# EAGLE design ema-module (EAGLE 9.6.2)
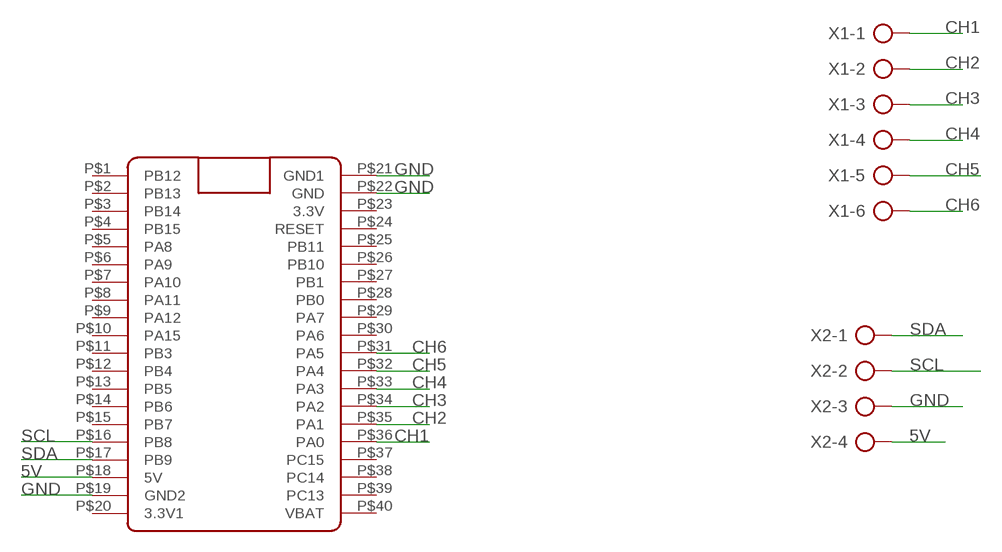
[diagram p0: schematic, sheet 1]

## Parts
U$1  BLUE_PILL  [BLUE_PILL]
X1  AK500/6-H  [AK500/6-H]
X2  AK500/4-H  [AK500/4-H]

## Nets
5V: U$1.P$18(5V) X2.4
CH1: U$1.P$36(PA0) X1.1
CH2: U$1.P$35(PA1) X1.2
CH3: U$1.P$34(PA2) X1.3
CH4: U$1.P$33(PA3) X1.4
CH5: U$1.P$32(PA4) X1.5
CH6: U$1.P$31(PA5) X1.6
GND: U$1.P$19(GND2) U$1.P$21(GND1) U$1.P$22(GND) X2.3
SCL: U$1.P$16(PB8) X2.2
SDA: U$1.P$17(PB9) X2.1
Unconnected: U$1.P$1(PB12) U$1.P$2(PB13) U$1.P$3(PB14) U$1.P$4(PB15) U$1.P$5(PA8) U$1.P$6(PA9) U$1.P$7(PA10) U$1.P$8(PA11) U$1.P$9(PA12) U$1.P$10(PA15) U$1.P$11(PB3) U$1.P$12(PB4) U$1.P$13(PB5) U$1.P$14(PB6) U$1.P$15(PB7) U$1.P$20(3.3V1) U$1.P$23(3.3V) U$1.P$24(RESET) U$1.P$25(PB11) U$1.P$26(PB10) U$1.P$27(PB1) U$1.P$28(PB0) U$1.P$29(PA7) U$1.P$30(PA6) U$1.P$37(PC15) U$1.P$38(PC14) U$1.P$39(PC13) U$1.P$40(VBAT)

## Library data of the parts
U$1 = BluePill:BLUE_PILL
X1 = con-ptr500:AK500/6-H: CONNECTOR Aug. 2004 / PTR Meßtechnik: Die Bezeichnung der Serie AK505 wurde geändert. Es handelt sich hierbei um AK500 in horizontaler Ausführung.
X2 = con-ptr500:AK500/4-H: CONNECTOR Aug. 2004 / PTR Meßtechnik: Die Bezeichnung der Serie AK505 wurde geändert. Es handelt sich hierbei um AK500 in horizontaler Ausführung.; OC_FARNELL: unknown; OC_NEWARK: unknown

## Board
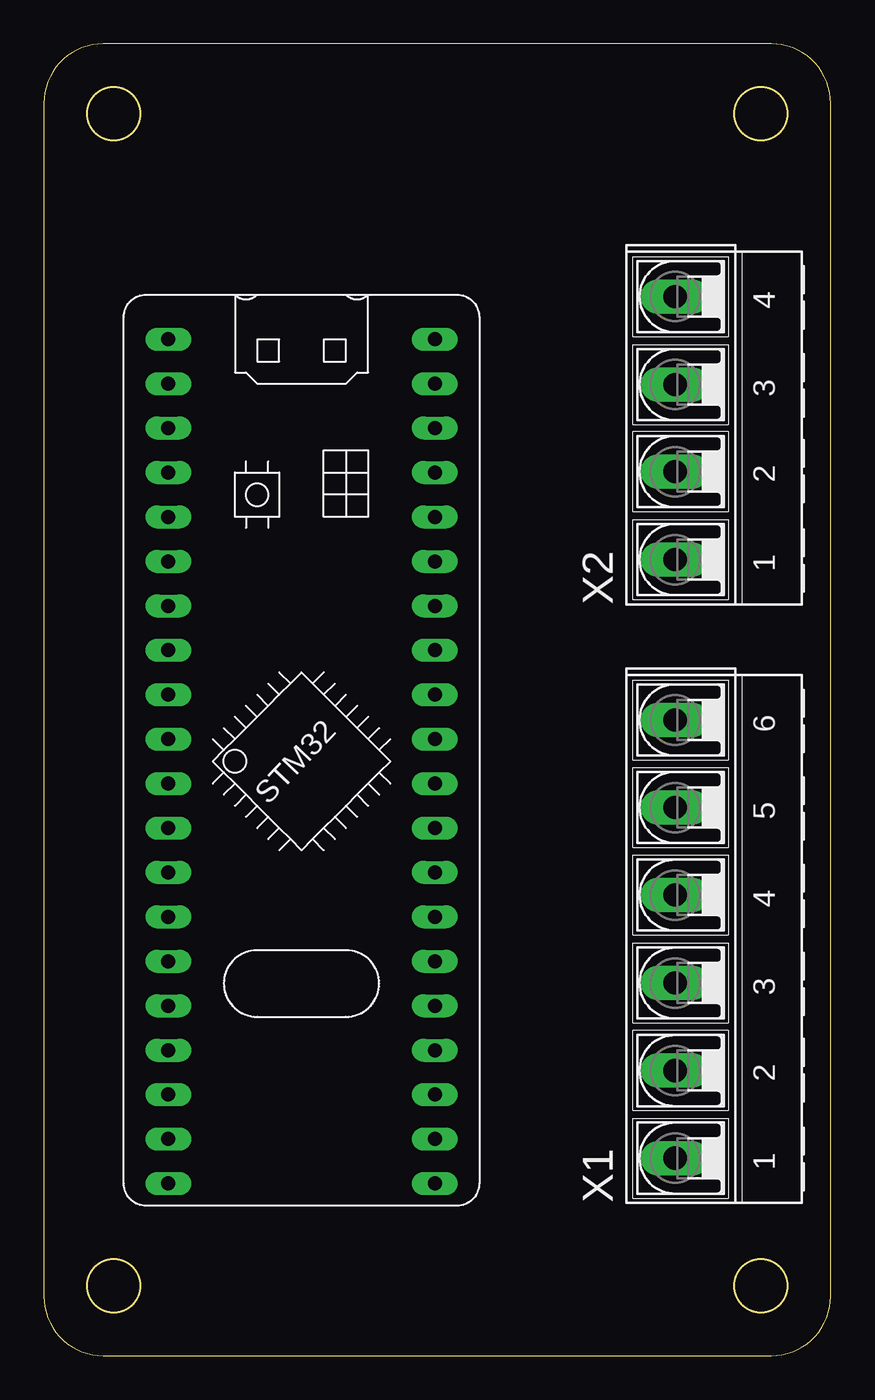
[diagram p1: board, top side]
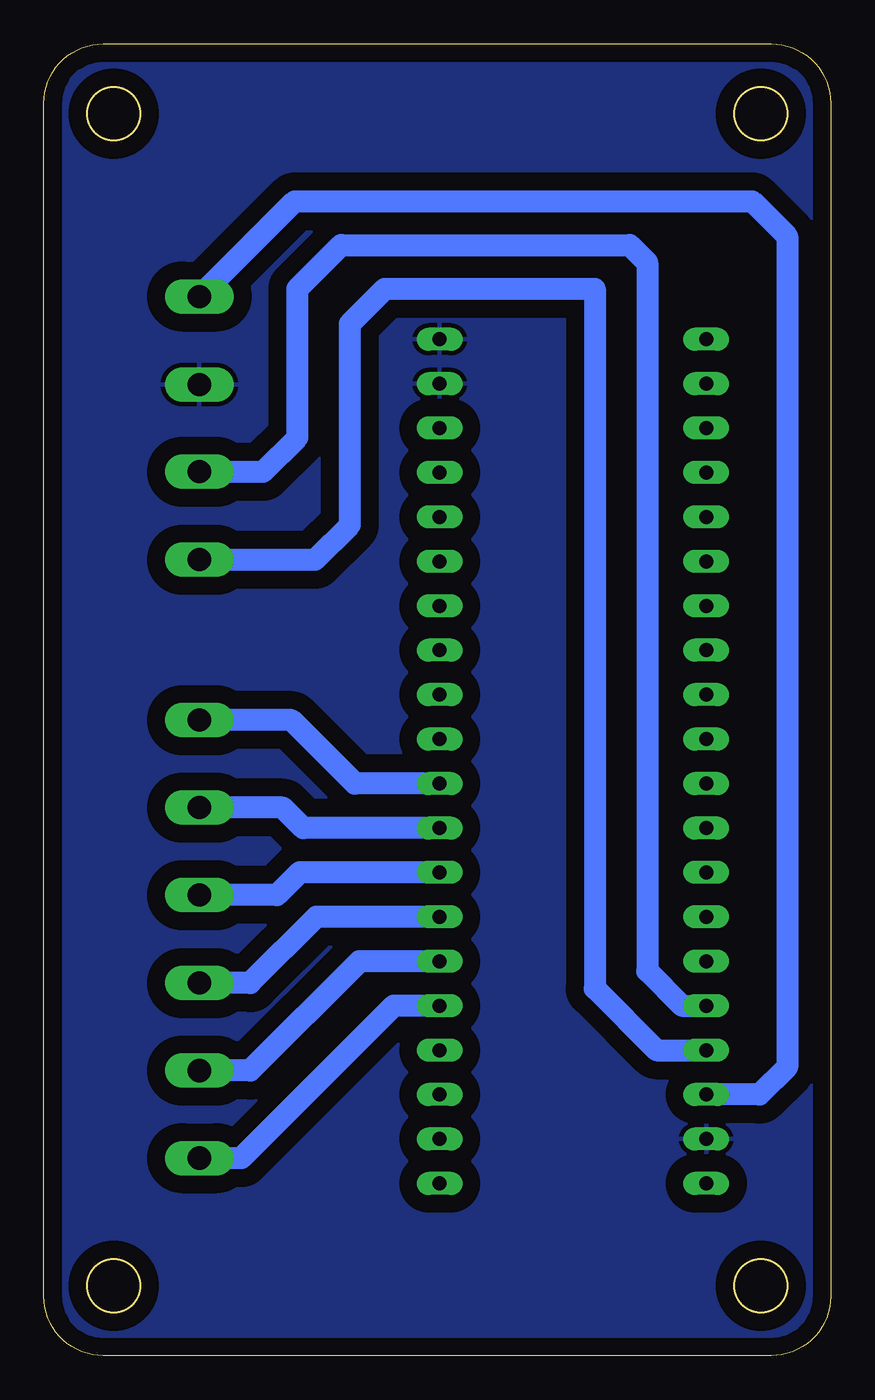
[diagram p2: board, bottom side, seen from below]

Size 45 x 75 mm. Coordinates in mm from the lower left corner, seen from the top.
Outline: 45,3.41 45,71.59 arc90 41.59,75 3.41,75 arc90 0,71.59 0,3.41 arc90 3.41,0 41.59,0 arc90 45,3.41
Outline: circle at 4,71 radius 1.5
Outline: circle at 41,71 radius 1.5
Outline: circle at 4,4 radius 1.5
Outline: circle at 41,4 radius 1.5
Copper layers (1*16): Top 0.035mm / dielectric 1.5mm / Bottom 0.035mm
Design rules "default *": minimum track width 6mil, minimum drill 0.35mm, track to track 40mil, track to pad 40mil, pad to pad 6mil, via to via 6mil, smd to smd 6mil, copper to edge 40mil, drill to drill 6mil, minimum pad ring 10mil, minimum via ring 8mil, stop-mask expansion 4mil, vias tented up to drill 0mil, thermal gap 10mil

### Footprints (pad centres in the part's own frame; a part is rotated, then mirrored left to right if it is on the bottom)
BLUE_PILL = drill 0.8 long: P$1 -7.62,15.24; P$2 -7.62,12.7; P$3 -7.62,10.16; P$4 -7.62,7.62; P$5 -7.62,5.08; P$6 -7.62,2.54; P$7 -7.62,0; P$8 -7.62,-2.54; P$9 -7.62,-5.08; P$10 -7.62,-7.62; P$11 -7.62,-10.16; P$12 -7.62,-12.7; P$13 -7.62,-15.24; P$14 -7.62,-17.78; P$15 -7.62,-20.32; P$16 -7.62,-22.86; P$17 -7.62,-25.4; P$18 -7.62,-27.94; P$19 -7.62,-30.48; P$20 -7.62,-33.02; P$21 7.62,15.24; P$22 7.62,12.7; P$23 7.62,10.16; P$24 7.62,7.62; P$25 7.62,5.08; P$26 7.62,2.54; P$27 7.62,0; P$28 7.62,-2.54; P$29 7.62,-5.08; P$30 7.62,-7.62; P$31 7.62,-10.16; P$32 7.62,-12.7; P$33 7.62,-15.24; P$34 7.62,-17.78; P$35 7.62,-20.32; P$36 7.62,-22.86; P$37 7.62,-25.4; P$38 7.62,-27.94; P$39 7.62,-30.48; P$40 7.62,-33.02
AK500/6-H = drill 1.321 long: 1 -12.522,0; 2 -7.518,0; 3 -2.515,0; 4 2.515,0; 5 7.518,0; 6 12.522,0
AK500/4-H = drill 1.321 long: 1 -7.518,0; 2 -2.489,0; 3 2.489,0; 4 7.518,0

### Placement (x,y rotation side)
U$1  14.74,42.87 0 top
X1  36.1,23.82 90 top
X2  36.1,53.03 90 top

### Tracks (layer width: path | path; a pad name or v marks a point on that pad's centre or on a via)
5V
  Bottom 1.27: X2.4 30.65,66 4.5,66 2.5,64 2.5,16.5 4.07,14.93 U$1.P$18
CH1
  Bottom 1.27: U$1.P$36 24.99,20.01 33.7,11.3 X1.1
CH2
  Bottom 1.27: U$1.P$35 26.95,22.55 33.2,16.3 X1.2
CH3
  Bottom 1.27: U$1.P$34 29.41,25.09 33.2,21.3 X1.3
CH4
  Bottom 1.27: U$1.P$33 30.37,27.63 31.66,26.34 X1.4
CH5
  Bottom 1.27: U$1.P$32 30.17,30.17 31.34,31.34 X1.5
CH6
  Bottom 1.27: U$1.P$31 27.21,32.71 30.84,36.34 X1.6
GND
  pour Bottom: 41.5,1 3.5,1 arc-90 1,3.5 1,71.5 arc-90 3.5,74 41.5,74 arc-90 44,71.5 44,3.5 arc-90
SCL
  Bottom 1.27: X2.2 32.46,50.54 30.5,52.5 30.5,61 28,63.5 11.5,63.5 10.5,62.5 10.5,22 8.51,20.01 U$1.P$16
SDA
  Bottom 1.27: X2.1 29.49,45.51 27.5,47.5 27.5,59 25.5,61 13.5,61 13.5,21 9.97,17.47 U$1.P$17